# EAGLE design sensorboard_radiation_rev1 (EAGLE 6.5.0)
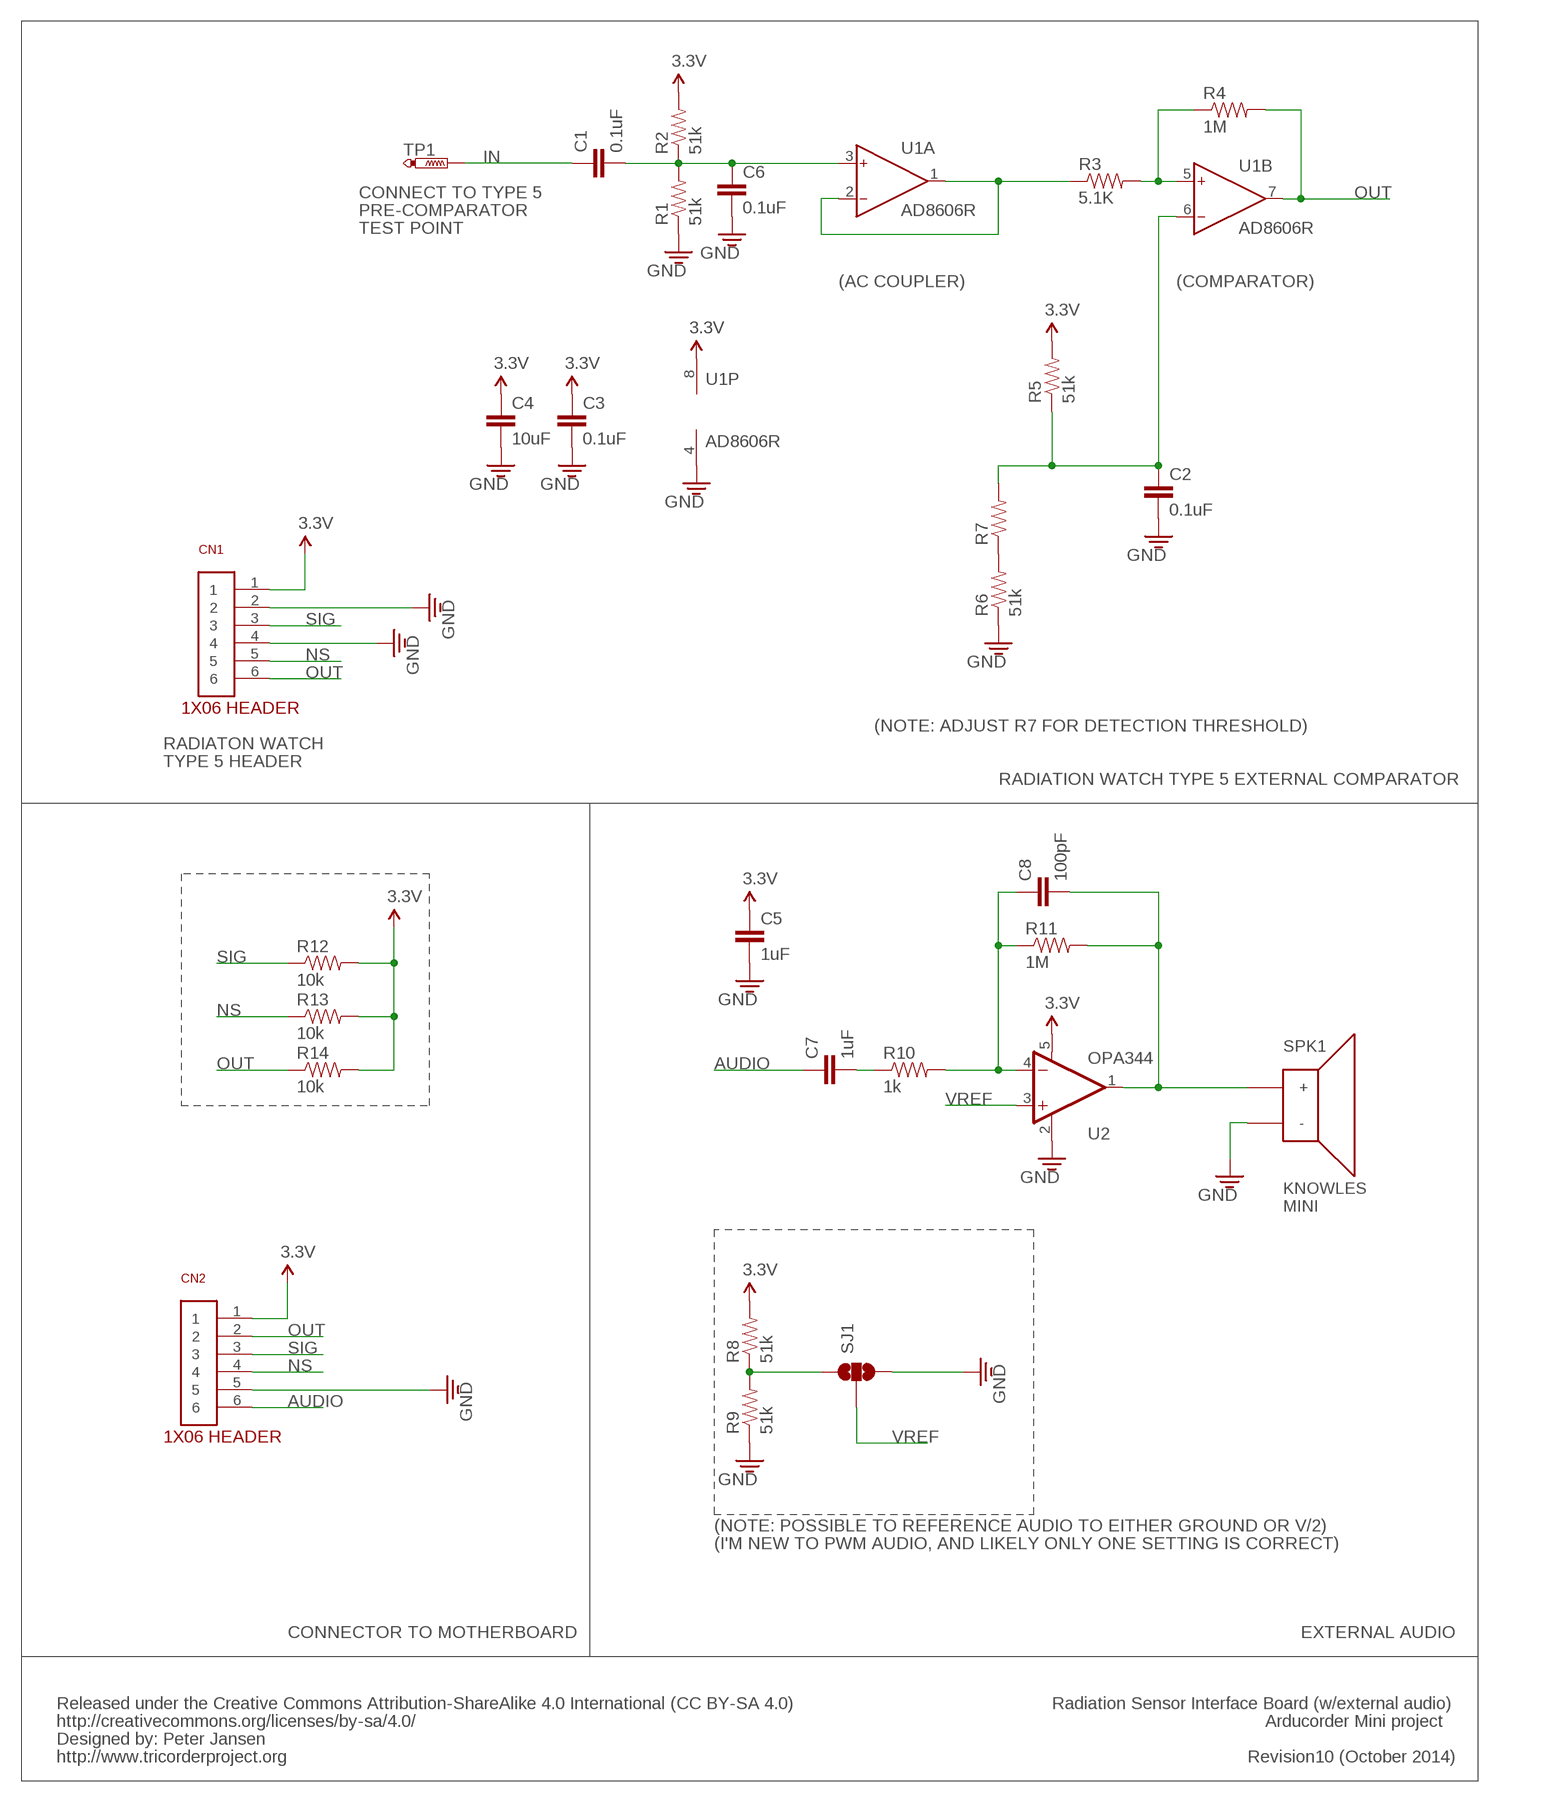
[diagram p0: schematic, sheet 1]

## Parts
C1  0.1uF  CAP0603  [0603]
C2  0.1uF  CAP0603  [0603]
C3  0.1uF  CAP0603  [0603]
C4  10uF  CAP0603  [0603]
C5  1uF  CAP0603  [0603]
C6  0.1uF  CAP0603  [0603]
C7  1uF  CAP0603  [0603]
C8  100pF  CAP0603  [0603]
CN1  1X06  [1X06]
CN2  PHT-106-01-L-S  1X06  [1X06]
R1  51k  RESISTOR0603  [0603]
R2  51k  RESISTOR0603  [0603]
R3  5.1K  RESISTOR0603  [0603]
R4  1M  RESISTOR0603  [0603]
R5  51k  RESISTOR0603  [0603]
R6  51k  RESISTOR0603  [0603]
R7  RESISTOR0603  [0603]
R8  51k  RESISTOR0603  [0603]
R9  51k  RESISTOR0603  [0603]
R10  1k  RESISTOR0603  [0603]
R11  1M  RESISTOR0603  [0603]
R12  10k  RESISTOR0603  [0603]
R13  10k  RESISTOR0603  [0603]
R14  10k  RESISTOR0603  [0603]
SJ1  SOLDERJUMPER_2WAYPASTE1&2  [SJ_3_PASTE1&2]
SPK1  KNOWLES-MINI-SPEAKER  [KNOWLES-MINI-SPEAKER]
TP1  PTR1PAD1-13  [P1-13]
U1  AD8606R  AD8607R  [SO8]
U2  OPA344  [SOT23-5]

## Nets
3.3V: C3.1 C4.1 C5.1 CN1.1 CN2.1 R2.2 R5.2 R8.2 R12.2 R13.2 R14.2 U1.8(P:V+) U2.5(V+)
ADMP_OUT: C8.2 R11.2 SPK1.POS(+) U2.1(OUT)
AUDIO: C7.1 CN2.6
GND: C2.2 C3.2 C4.2 C5.2 C6.2 CN1.2 CN1.4 CN2.5 R1.1 R6.1 R9.1 SJ1.3 SPK1.NEG(-) U1.4(P:V-) U2.2(V-)
IN: C1.1 TP1.TP
N$1: R6.2 R7.1
N$2: C1.2 C6.1 R1.2 R2.1 U1.3(A:IN+)
N$3: R3.1 U1.1(A:OUT) U1.2(A:IN-)
N$4: R3.2 R4.1 U1.5(B:IN+)
N$8: C2.1 R5.1 R7.2 U1.6(B:IN-)
N$51: C7.2 R10.1
N$52: C8.1 R10.2 R11.1 U2.4(-IN)
NS: CN1.5 CN2.4 R13.1
OUT: CN1.6 CN2.2 R4.2 R14.1 U1.7(B:OUT)
SIG: CN1.3 CN2.3 R12.1
VREF: SJ1.2 U2.3(+IN)
VREF1: R8.1 R9.2 SJ1.1

## Notes on the sheet
- CONNECT TO TYPE 5
- PRE-COMPARATOR
- TEST POINT
- (AC COUPLER) | (COMPARATOR)
- (NOTE: ADJUST R7 FOR DETECTION THRESHOLD)
- RADIATON WATCH
- TYPE 5 HEADER
- RADIATION WATCH TYPE 5 EXTERNAL COMPARATOR
- (NOTE: POSSIBLE TO REFERENCE AUDIO TO EITHER GROUND OR V/2)
- (I'M NEW TO PWM AUDIO, AND LIKELY ONLY ONE SETTING IS CORRECT)
- CONNECTOR TO MOTHERBOARD | EXTERNAL AUDIO
- Released under the Creative Commons Attribution-ShareAlike 4.0 International (CC BY-SA 4.0) | Radiation Sensor Interface Board (w/external audio)
- http://creativecommons.org/licenses/by-sa/4.0/ | Arducorder Mini project
- Designed by: Peter Jansen
- http://www.tricorderproject.org | Revision10 (October 2014)

## Library data of the parts
C1-C4 C6 = arm:CAP: Capacitor Standard 0603 ceramic capacitor, and 0.1" leaded capacitor.
C5 C7 C8 = notes_mark5a:CAP: Capacitor Standard 0603 ceramic capacitor, and 0.1" leaded capacitor.
CN1 = arm:1X06
CN2 = arm1a:1X06
R1-R7 R12-R14 = arm:RESISTOR: Resistor Basic schematic elements and footprints for 0603, 1206, and PTH 1/10th watt (small) resistors.
R8-R11 = notes_mark5a:RESISTOR: Resistor Basic schematic elements and footprints for 0603, 1206, and PTH 1/10th watt (small) resistors.
SJ1 = SparkFun-Passives:SOLDERJUMPER_2WAY: Solder Jumper 2 way solder jumper
SPK1 = notes-arducorder-mini:KNOWLES-MINI-SPEAKER: Knowles mini-speaker (Part #2403 260 00106)
TP1 = testpad:PTR1: TEST PIN
U1 = analog-devices:AD8607: Precision Micropower, Low Noise CMOS, Rail-to-Rail Input/Output Operational Amplifiers Source: http://www.analog.com/static/imported-files/data_sheets/AD8603_8607_8609.pdf; MPN: AD8607ARMZ-R2; OC_FARNELL: 1651293; OC_NEWARK: 19M8927
U2 = SparkFun-AnalogIC:OPA344: Single gate rail-to-rail output op-amp. Inputs extend 300mV past rails.

## Board
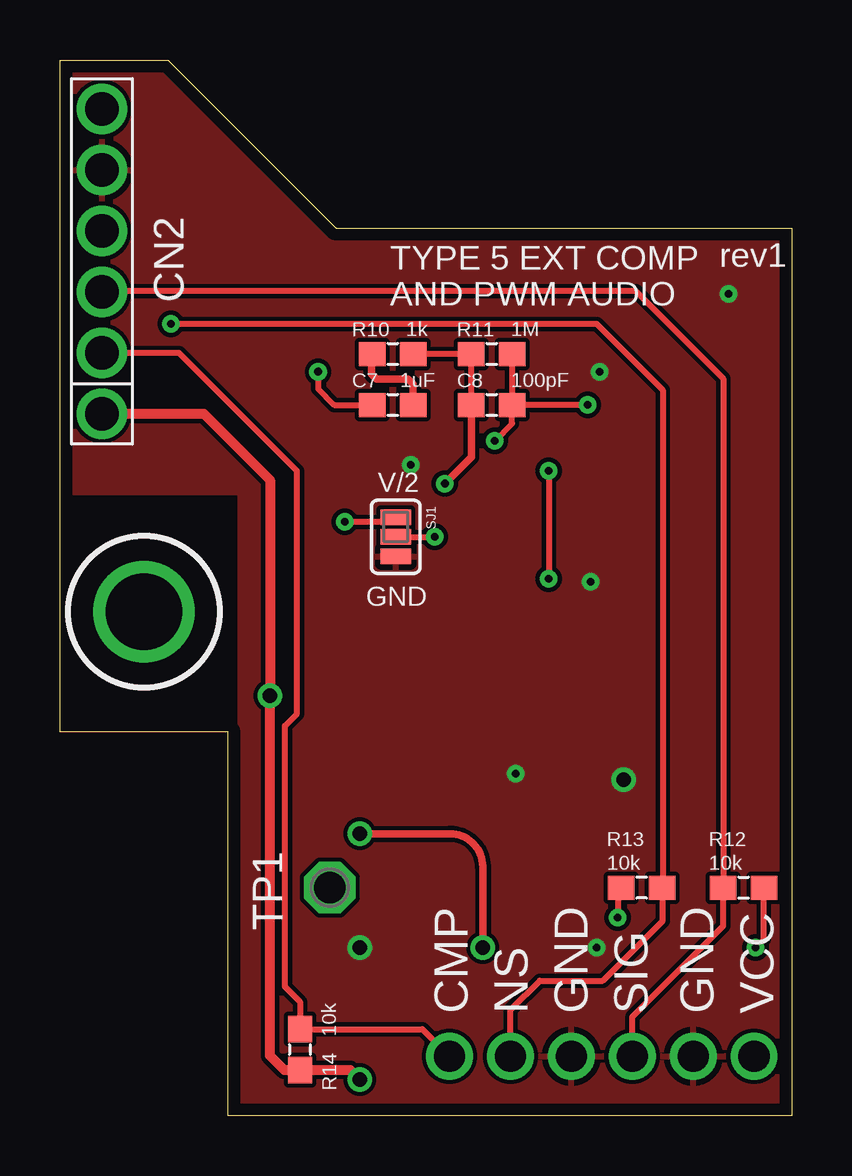
[diagram p1: board, top side]
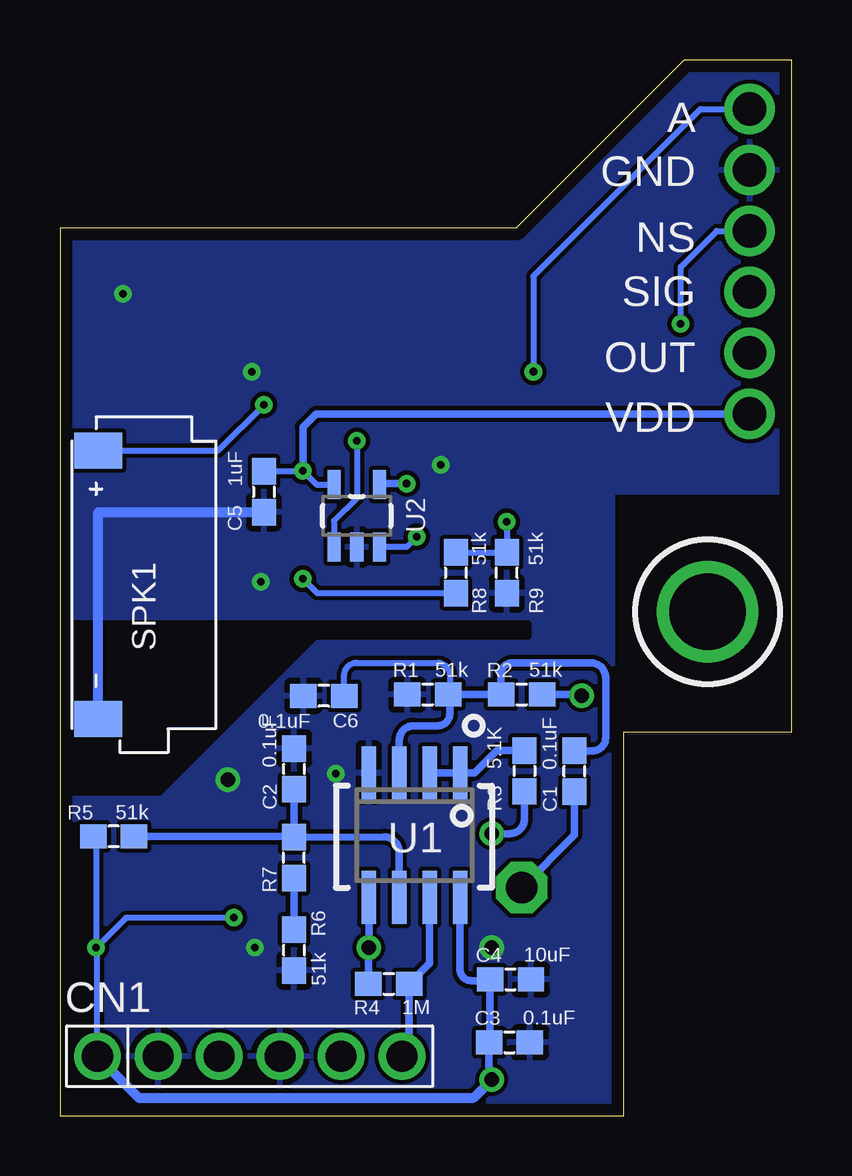
[diagram p2: board, bottom side, seen from below]

Size 30.5 x 44 mm. Coordinates in mm from the lower left corner, seen from the top.
Outline: 7,0 7,16 0,16 0,44 4.5,44 11.5,37 30.5,37 30.5,0 7,0
Copper layers (1*16): Top 0.035mm / dielectric 1.5mm / Bottom 0.035mm
Design rules "default *": minimum track width 8mil, minimum drill 13mil, track to track 7mil, track to pad 7mil, pad to pad 7mil, via to via 7mil, smd to smd 7mil, copper to edge 20mil, drill to drill 8mil, minimum pad ring 10mil, minimum via ring 8mil, stop-mask expansion 4mil, vias tented up to drill 0mil, thermal gap 10mil
bRestrict: area 11,13.5 to 30.5,20.5

### Footprints (pad centres in the part's own frame; a part is rotated, then mirrored left to right if it is on the bottom)
0603 = smd 1.1 x 1: 1 -0.85,0; 2 0.85,0
1X06 = drill 1.3: 1 0,0; 2 2.54,0; 3 5.08,0; 4 7.62,0; 5 10.16,0; 6 12.7,0
1X06' = drill 1.4: 1 0,0; 2 2.54,0; 3 5.08,0; 4 7.62,0; 5 10.16,0; 6 12.7,0
SJ_3_PASTE1&2 = smd 0.635 x 1.27: 1 -0.813,0; 2 0,0; 3 0.813,0
KNOWLES-MINI-SPEAKER = smd 1.5 x 2: NEG -5.6,1.9; POS 5.6,1.9
P1-13 = drill 1.321 pad 2.159 octagon: TP 0,0
SO8 = smd 0.6 x 2.2: 1 -1.905,-2.6; 2 -0.635,-2.6; 3 0.635,-2.6; 4 1.905,-2.6; 5 1.905,2.6; 6 0.635,2.6; 7 -0.635,2.6; 8 -1.905,2.6
SOT23-5 = smd 0.55 x 1.2: 1 -0.95,-1.3; 2 0,-1.3; 3 0.95,-1.3; 4 0.95,1.3; 5 -0.95,1.3

### Placement (x,y rotation side)
C1  9.05,14.36 90 bottom
C2  20.73,14.45 90 bottom
C3  11.76,3.05 0 bottom
C4  11.71,5.67 0 bottom
C5  22,26 270 bottom
C6  19.5,17.5 180 bottom
C7  13.88,29.62 0 top
C8  18,29.62 0 top
CN1  28.94,2.47 0 bottom
CN2  PHT-106-01-L-S  [1X06']  1.75,29.25 90 top
R1  15.17,17.55 0 bottom
R2  11.25,17.55 0 bottom
R3  11.14,14.36 270 bottom
R4  16.8,5.49 0 bottom
R5  28.26,11.64 180 bottom
R6  20.73,6.89 90 bottom
R7  20.75,10.75 90 bottom
R8  14,22.62 270 bottom
R9  11.88,22.62 90 bottom
R10  13.88,31.75 0 top
R11  18,31.75 0 top
R12  28.5,9.5 0 top
R13  24.25,9.5 180 top
R14  10,2.75 270 top
SJ1  14,24.12 270 top
SPK1  27,22.12 90 bottom
TP1  11.25,9.5 180 top
U1  15.72,11.69 180 bottom
U2  18.12,25 0 bottom

### Tracks (layer width: path | path; a pad name or v marks a point on that pad's centre or on a via)
3.3V  (via drill 0.33, 0.6)
  Top 0.254: v20.38,26.88 v20.38,22.38 | v29,7 29.35,7.35 R12.2 | R13.2 23.25,9.35 v23.25,8.25
  Top 0.406: CN2.1 6,29.25 8.75,26.5 v8.75,17.5 8.75,2.5 9.35,1.9 R14.2 12.1,1.9 v12.5,1.5
  Bottom 0.254: C5.1 22,26.88 v20.38,26.88 19.8,26.3 U2.5 19.15,26.38 | v20.38,22.38 19.77,21.77 R8.2 | CN1.1 28.94,6.94 v29,7 | R5.2 29,11.53 v29,7 | v23.25,8.25 27.75,8.25 v29,7
  Bottom 0.305: U1.8 13.81,6.07 arc-90 13.38,5.62 12.62,5.62 arc-90 C4.1 | 12.3,5.67 C4.1 | C4.1 12.56,3.09 C3.1 12.61,1.64 v12.5,1.5 | v8.75,17.5 8.57,17.55 R2.2 | CN2.1 19.83,29.25 20.38,28.71 v20.38,26.88
  Bottom 0.406: CN1.1 27.22,0.75 13.25,0.75 v12.5,1.5
ADMP_OUT  (via drill 0.33)
  Top 0.254: R11.2 C8.2 | v22,29.62 C8.2 | v18.12,28.12 18.85,28.85 C8.2
  Bottom 0.254: v18.12,28.12 18.12,25.75 19.07,24.8 U2.1 | SPK1.POS 23.9,27.73 v22,29.62
AUDIO  (via drill 0.33)
  Top 0.254: v10.76,31 10.76,30.29 11.43,29.62 C7.1
  Bottom 0.254: CN2.6 3.8,41.95 10.76,34.99 v10.76,31
GND  (via drill 0.33, 0.6)
  Bottom 0.406: SPK1.NEG 28.9,25.15 C5.2
  other vias: 23.5,14 12.5,7 22.38,7 14.62,27.12 27.88,34.25 22.12,22.25 19,14.25 22.5,31
  pour Bottom: 7.5,0 30.5,0 30.5,37 11.5,37 4.5,44 0,44 0,26 7.5,26
  pour Top: 0,44 0,26 7.5,26 7.5,0 30.5,0 30.5,37 11.5,37 4.5,44
IN
  Bottom 0.305: C1.1 9.05,11.7 TP1.TP
N$1
  Bottom 0.305: R6.2 20.73,9.88 R7.1
N$2
  Bottom 0.254: C6.1 18.65,18.35 arc90 18.12,18.88 14.75,18.88 arc90 14.25,18.38 14.25,17.62 arc90 R1.2
  Bottom 0.305: U1.3 16.36,15.64 arc90 15.75,16.25 14.75,16.25 arc-90 14.25,16.75 14.25,17.48 arc-90 R1.2 R2.1 arc90 12.12,17.57 12.12,18.38 arc90 11.62,18.88 8.38,18.88 arc90 7.75,18.25 7.75,15.75 arc90 8.29,15.2 C1.2
N$3
  Bottom 0.305: U1.2 U1.1 13.21,14.29 12.29,15.21 R3.1
N$4  (via drill 0.6)
  Top 0.305: v12.5,11.75 16.25,11.75 arc-90 17.62,10.38 v17.62,7
  Bottom 0.305: R3.2 11.14,12.36 arc90 11.75,11.75 v12.5,11.75 | U1.5 v17.62,7 arc-90 17.64,6.98 R4.1
N$5  (via drill 3.2)
  other vias: 3.5,21
N$8
  Bottom 0.305: U1.6 16.36,10.98 arc-90 17,11.62 R7.2 | C2.1 20.73,11.62 R7.2 | R5.1 20.79,11.64 R7.2
N$51
  Top 0.305: C7.2 14.72,30.5 14.52,30.7 13.2,30.7 13,30.9 13,31.72 R10.1
N$52  (via drill 0.33)
  Top 0.254: 17.18,29.6 C8.1 R11.1 R10.2
  Top 0.305: v16.05,26.34 17.15,27.44 C8.1
  Bottom 0.305: U2.4 17.14,26.34 v16.05,26.34
NS  (via drill 0.33)
  Top 0.254: CN1.5 18.78,4.41 20,5.62 22.62,5.62 25.12,8.12 25.12,9.47 R13.1 25.12,9.53 25.12,30.25 22.38,33 v4.62,33
  Bottom 0.254: v4.62,33 4.62,35.38 3.12,36.88 CN2.4
OUT
  Top 0.254: CN2.2 4.96,31.79 9.88,26.88 9.88,16.75 9.38,16.25 9.38,5.38 10,4.75 R14.1 15.11,3.6 CN1.6
  Bottom 0.254: 15.95,2.77 CN1.6
  Bottom 0.305: 15.95,2.77 R4.2 15.09,6.34 U1.7
SIG
  Top 0.254: CN1.3 23.86,4.11 27.65,7.9 R12.1 27.65,30.73 24,34.38 1.79,34.38 CN2.3
VREF  (via drill 0.33)
  Top 0.254: SJ1.2 v15.62,24.12
  Bottom 0.254: 17.1,23.62 U2.3 16.05,23.7 v15.62,24.12
VREF1  (via drill 0.33)
  Top 0.254: SJ1.1 14,24.75 v11.88,24.75
  Bottom 0.254: R8.1 R9.2 v11.88,24.75

### Text on the board
tPlace: TYPE 5 EXT COMP | rev1 | AND PWM AUDIO | V/2 | GND | CMP | NS | GND | SIG | GND | VCC
bPlace: A | GND | NS | SIG | OUT | VDD